# Altium project Pow_Dist_24_12_5v.PrjPcb
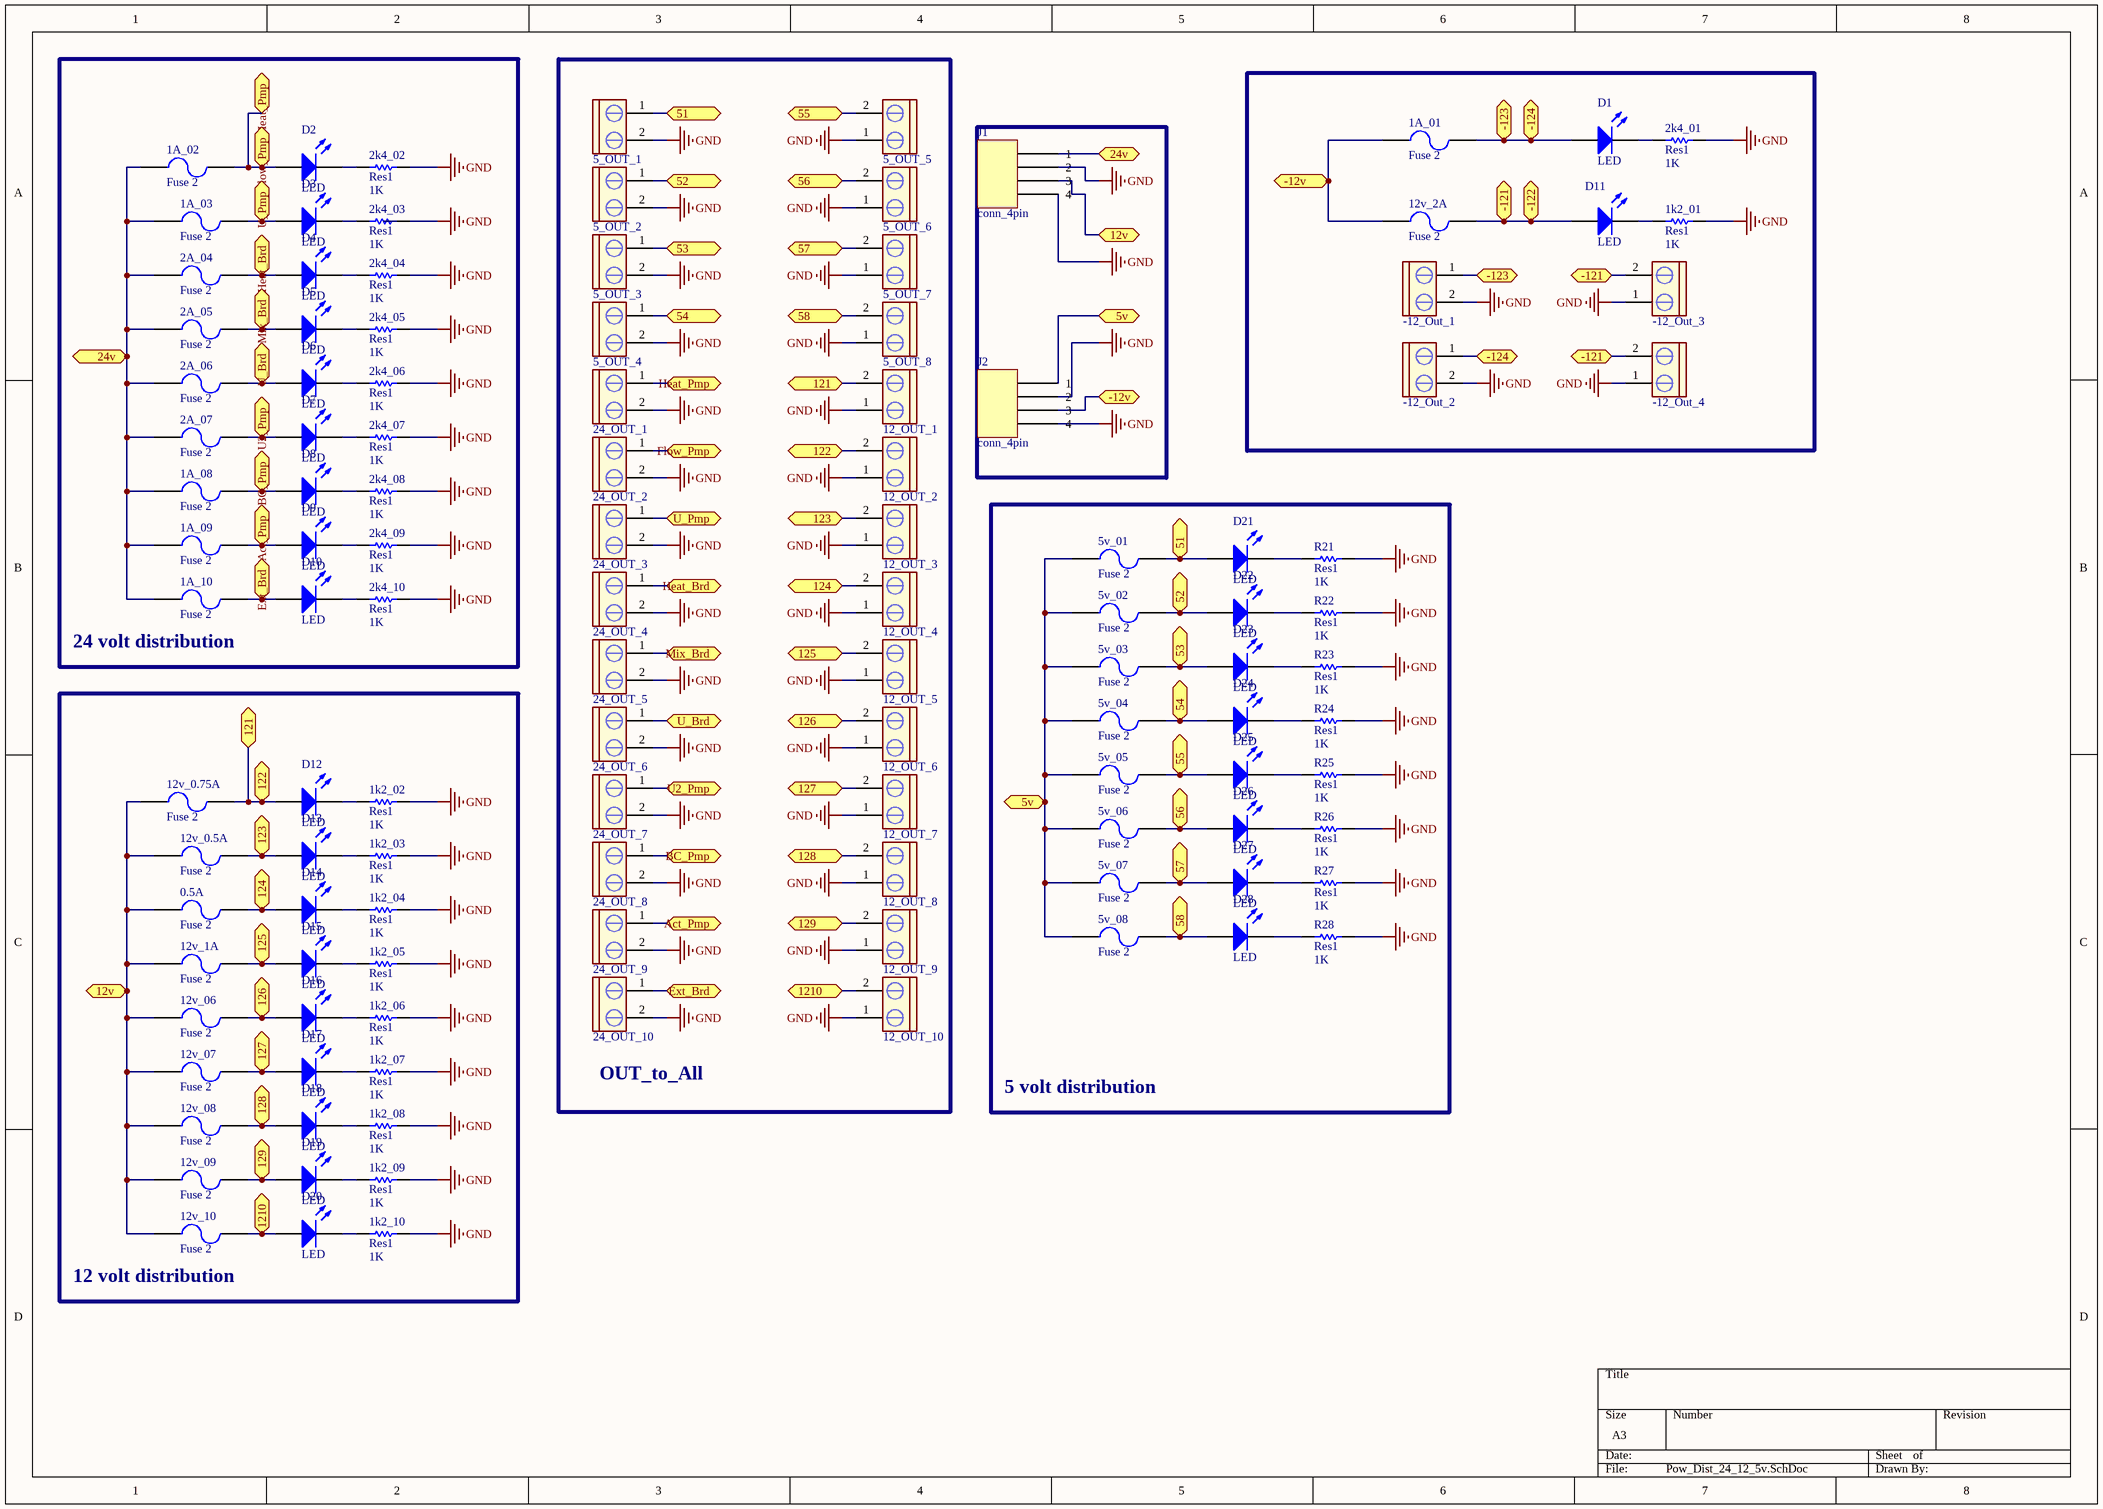
[diagram p0: Pow_Dist_24_12_5v.SchDoc]
2 sheets, 118 parts. Net scope: flat (ports and power ports of the same name join across sheets).
Board file: Pow_Dist_24_12_5v.PcbDoc
Sheets:
  Pow_Dist_24_12_5v.SchDoc
  Pow_Dist_24_12_5v_page2.SchDoc

## Sheet Pow_Dist_24_12_5v.SchDoc
size A3

### Parts
0.5A  Fuse 2  [PCBComponent_1]
1A_01  Fuse 2  [PCBComponent_1]
1A_02  Fuse 2  [PCBComponent_1]
1A_03  Fuse 2  [PCBComponent_1]
1A_08  Fuse 2  [PCBComponent_1]
1A_09  Fuse 2  [PCBComponent_1]
1A_10  Fuse 2  [PCBComponent_1]
1k2_01  Res1  value 1K  [AXIAL-0.3]
1k2_02  Res1  value 1K  [AXIAL-0.3]
1k2_03  Res1  value 1K  [AXIAL-0.3]
1k2_04  Res1  value 1K  [AXIAL-0.3]
1k2_05  Res1  value 1K  [AXIAL-0.3]
1k2_06  Res1  value 1K  [AXIAL-0.3]
1k2_07  Res1  value 1K  [AXIAL-0.3]
1k2_08  Res1  value 1K  [AXIAL-0.3]
1k2_09  Res1  value 1K  [AXIAL-0.3]
1k2_10  Res1  value 1K  [AXIAL-0.3]
2A_04  Fuse 2  [PCBComponent_1]
2A_05  Fuse 2  [PCBComponent_1]
2A_06  Fuse 2  [PCBComponent_1]
2A_07  Fuse 2  [PCBComponent_1]
2k4_01  Res1  value 1K  [AXIAL-0.3]
2k4_02  Res1  value 1K  [AXIAL-0.3]
2k4_03  Res1  value 1K  [AXIAL-0.3]
2k4_04  Res1  value 1K  [AXIAL-0.3]
2k4_05  Res1  value 1K  [AXIAL-0.3]
2k4_06  Res1  value 1K  [AXIAL-0.3]
2k4_07  Res1  value 1K  [AXIAL-0.3]
2k4_08  Res1  value 1K  [AXIAL-0.3]
2k4_09  Res1  value 1K  [AXIAL-0.3]
2k4_10  Res1  value 1K  [AXIAL-0.3]
5_OUT_1  CON2 pin blue  [My_CN2]  (value not drawn)
5_OUT_2  CON2 pin blue  [My_CN2]  (value not drawn)
5_OUT_3  CON2 pin blue  [My_CN2]  (value not drawn)
5_OUT_4  CON2 pin blue  [My_CN2]  (value not drawn)
5_OUT_5  CON2 pin blue  [My_CN2]  (value not drawn)
5_OUT_6  CON2 pin blue  [My_CN2]  (value not drawn)
5_OUT_7  CON2 pin blue  [My_CN2]  (value not drawn)
5_OUT_8  CON2 pin blue  [My_CN2]  (value not drawn)
5v_01  Fuse 2  [PCBComponent_1]
5v_02  Fuse 2  [PCBComponent_1]
5v_03  Fuse 2  [PCBComponent_1]
5v_04  Fuse 2  [PCBComponent_1]
5v_05  Fuse 2  [PCBComponent_1]
5v_06  Fuse 2  [PCBComponent_1]
5v_07  Fuse 2  [PCBComponent_1]
5v_08  Fuse 2  [PCBComponent_1]
12_OUT_1  CON2 pin blue  [My_CN2]  (value not drawn)
12_OUT_2  CON2 pin blue  [My_CN2]  (value not drawn)
12_OUT_3  CON2 pin blue  [My_CN2]  (value not drawn)
12_OUT_4  CON2 pin blue  [My_CN2]  (value not drawn)
12_OUT_5  CON2 pin blue  [My_CN2]  (value not drawn)
12_OUT_6  CON2 pin blue  [My_CN2]  (value not drawn)
12_OUT_7  CON2 pin blue  [My_CN2]  (value not drawn)
12_OUT_8  CON2 pin blue  [My_CN2]  (value not drawn)
12_OUT_9  CON2 pin blue  [My_CN2]  (value not drawn)
12_OUT_10  CON2 pin blue  [My_CN2]  (value not drawn)
12v_0.5A  Fuse 2  [PCBComponent_1]
12v_0.75A  Fuse 2  [PCBComponent_1]
12v_1A  Fuse 2  [PCBComponent_1]
12v_2A  Fuse 2  [PCBComponent_1]
12v_06  Fuse 2  [PCBComponent_1]
12v_07  Fuse 2  [PCBComponent_1]
12v_08  Fuse 2  [PCBComponent_1]
12v_09  Fuse 2  [PCBComponent_1]
12v_10  Fuse 2  [PCBComponent_1]
24_OUT_1  CON2 pin blue  [My_CN2]  (value not drawn)
24_OUT_2  CON2 pin blue  [My_CN2]  (value not drawn)
24_OUT_3  CON2 pin blue  [My_CN2]  (value not drawn)
24_OUT_4  CON2 pin blue  [My_CN2]  (value not drawn)
24_OUT_5  CON2 pin blue  [My_CN2]  (value not drawn)
24_OUT_6  CON2 pin blue  [My_CN2]  (value not drawn)
24_OUT_7  CON2 pin blue  [My_CN2]  (value not drawn)
24_OUT_8  CON2 pin blue  [My_CN2]  (value not drawn)
24_OUT_9  CON2 pin blue  [My_CN2]  (value not drawn)
24_OUT_10  CON2 pin blue  [My_CN2]  (value not drawn)
-12_Out_1  CON2 pin blue  [My_CN2]  (value not drawn)
-12_Out_2  CON2 pin blue  [My_CN2]  (value not drawn)
-12_Out_3  CON2 pin blue  [My_CN2]  (value not drawn)
-12_Out_4  CON2 pin blue  [My_CN2]  (value not drawn)
D1  LED  [My_LED3MM]
D2  LED  [My_LED3MM]
D3  LED  [My_LED3MM]
D4  LED  [My_LED3MM]
D5  LED  [My_LED3MM]
D6  LED  [My_LED3MM]
D7  LED  [My_LED3MM]
D8  LED  [My_LED3MM]
D9  LED  [My_LED3MM]
D10  LED  [My_LED3MM]
D11  LED  [My_LED3MM]
D12  LED  [My_LED3MM]
D13  LED  [My_LED3MM]
D14  LED  [My_LED3MM]
D15  LED  [My_LED3MM]
D16  LED  [My_LED3MM]
D17  LED  [My_LED3MM]
D18  LED  [My_LED3MM]
D19  LED  [My_LED3MM]
D20  LED  [My_LED3MM]
D21  LED  [My_LED3MM]
D22  LED  [My_LED3MM]
D23  LED  [My_LED3MM]
D24  LED  [My_LED3MM]
D25  LED  [My_LED3MM]
D26  LED  [My_LED3MM]
D27  LED  [My_LED3MM]
D28  LED  [My_LED3MM]
J1  conn_4pin  [conn_4pin]
J2  conn_4pin  [conn_4pin]
R21  Res1  value 1K  [AXIAL-0.3]
R22  Res1  value 1K  [AXIAL-0.3]
R23  Res1  value 1K  [AXIAL-0.3]
R24  Res1  value 1K  [AXIAL-0.3]
R25  Res1  value 1K  [AXIAL-0.3]
R26  Res1  value 1K  [AXIAL-0.3]
R27  Res1  value 1K  [AXIAL-0.3]
R28  Res1  value 1K  [AXIAL-0.3]

### Blocks framed on the sheet
24 volt distribution: 1A_02 1A_03 1A_08 1A_09 1A_10 2A_04 2A_05 2A_06 2A_07 2k4_02 2k4_03 2k4_04 2k4_05 2k4_06 2k4_07 2k4_08 2k4_09 2k4_10 D2-D10
OUT_to_All: 5_OUT_1-5_OUT_8 12_OUT_1-12_OUT_10 24_OUT_1-24_OUT_10
5 volt distribution: 5v_01 5v_02 5v_03 5v_04 5v_05 5v_06 5v_07 5v_08 D21-D28 R21-R28
12 volt distribution: 0.5A 1k2_02 1k2_03 1k2_04 1k2_05 1k2_06 1k2_07 1k2_08 1k2_09 1k2_10 12v_0.5A 12v_0.75A 12v_1A 12v_06 12v_07 12v_08 12v_09 12v_10 D12-D20

### Ports
5v, 12v, 24v, 51, 52, 53, 54, 55, 56, 57, 58, 121, 122, 123, 124, 125, 126, 127, 128, 129, 1210, -12v, -121, -122, -123, -124, Act_Pmp, BC_Pmp, Ext_Brd, Flow_Pmp, Heat_Brd, Heat_Pmp, Mix_Brd, U2_Pmp, U_Brd, U_Pmp

### Nets
GND: 1k2_01.2 1k2_02.2 1k2_03.2 1k2_04.2 1k2_05.2 1k2_06.2 1k2_07.2 1k2_08.2 1k2_09.2 1k2_10.2 2k4_01.2 2k4_02.2 2k4_03.2 2k4_04.2 2k4_05.2 2k4_06.2 2k4_07.2 2k4_08.2 2k4_09.2 2k4_10.2 5_OUT_1.2 5_OUT_2.2 5_OUT_3.2 5_OUT_4.2 5_OUT_5.1 5_OUT_6.1 5_OUT_7.1 5_OUT_8.1 12_OUT_1.1 12_OUT_2.1 12_OUT_3.1 12_OUT_4.1 12_OUT_5.1 12_OUT_6.1 12_OUT_7.1 12_OUT_8.1 12_OUT_9.1 12_OUT_10.1 24_OUT_1.2 24_OUT_2.2 24_OUT_3.2 24_OUT_4.2 24_OUT_5.2 24_OUT_6.2 24_OUT_7.2 24_OUT_8.2 24_OUT_9.2 24_OUT_10.2 -12_Out_1.2 -12_Out_2.2 -12_Out_3.1 -12_Out_4.1 R21.2 R22.2 R23.2 R24.2 R25.2 R26.2 R27.2 R28.2
Net0.5A_1: 0.5A.1 12v_0.5A.1 12v_0.75A.1 12v_1A.1 12v_06.1 12v_07.1 12v_08.1 12v_09.1 12v_10.1 ; port 12v
Net0.5A_2: 0.5A.2 12_OUT_4.2 D14.A ; port 124
Net1A_01_1: 1A_01.1 12v_2A.1 ; port -12v
Net1A_01_2: 1A_01.2 -12_Out_1.1 -12_Out_2.1 D1.A ; port -123, port -124
Net1A_02_1: 1A_02.1 1A_03.1 1A_08.1 1A_09.1 1A_10.1 2A_04.1 2A_05.1 2A_06.1 2A_07.1 ; port 24v
Net1A_02_2: 1A_02.2 24_OUT_1.1 24_OUT_2.1 D2.A ; port Heat_Pmp, port Flow_Pmp
Net1A_03_2: 1A_03.2 24_OUT_3.1 D3.A ; port U_Pmp
Net1A_08_2: 1A_08.2 24_OUT_8.1 D8.A ; port BC_Pmp
Net1A_09_2: 1A_09.2 24_OUT_9.1 D9.A ; port Act_Pmp
Net1A_10_2: 1A_10.2 24_OUT_10.1 D10.A ; port Ext_Brd
Net1k2_01_1: 1k2_01.1 D11.K
Net1k2_02_1: 1k2_02.1 D12.K
Net1k2_03_1: 1k2_03.1 D13.K
Net1k2_04_1: 1k2_04.1 D14.K
Net1k2_05_1: 1k2_05.1 D15.K
Net1k2_06_1: 1k2_06.1 D16.K
Net1k2_07_1: 1k2_07.1 D17.K
Net1k2_08_1: 1k2_08.1 D18.K
Net1k2_09_1: 1k2_09.1 D19.K
Net1k2_10_1: 1k2_10.1 D20.K
Net2A_04_2: 2A_04.2 24_OUT_4.1 D4.A ; port Heat_Brd
Net2A_05_2: 2A_05.2 24_OUT_5.1 D5.A ; port Mix_Brd
Net2A_06_2: 2A_06.2 24_OUT_6.1 D6.A ; port U_Brd
Net2A_07_2: 2A_07.2 24_OUT_7.1 D7.A ; port U2_Pmp
Net2k4_01_1: 2k4_01.1 D1.K
Net2k4_02_1: 2k4_02.1 D2.K
Net2k4_03_1: 2k4_03.1 D3.K
Net2k4_04_1: 2k4_04.1 D4.K
Net2k4_05_1: 2k4_05.1 D5.K
Net2k4_06_1: 2k4_06.1 D6.K
Net2k4_07_1: 2k4_07.1 D7.K
Net2k4_08_1: 2k4_08.1 D8.K
Net2k4_09_1: 2k4_09.1 D9.K
Net2k4_10_1: 2k4_10.1 D10.K
Net5_OUT_1_1: 5_OUT_1.1 5v_01.2 D21.A ; port 51
Net5_OUT_2_1: 5_OUT_2.1 5v_02.2 D22.A ; port 52
Net5_OUT_3_1: 5_OUT_3.1 5v_03.2 D23.A ; port 53
Net5_OUT_4_1: 5_OUT_4.1 5v_04.2 D24.A ; port 54
Net5_OUT_5_2: 5_OUT_5.2 5v_05.2 D25.A ; port 55
Net5_OUT_6_2: 5_OUT_6.2 5v_06.2 D26.A ; port 56
Net5_OUT_7_2: 5_OUT_7.2 5v_07.2 D27.A ; port 57
Net5_OUT_8_2: 5_OUT_8.2 5v_08.2 D28.A ; port 58
Net5v_01_1: 5v_01.1 5v_02.1 5v_03.1 5v_04.1 5v_05.1 5v_06.1 5v_07.1 5v_08.1 ; port 5v
Net12_OUT_1_2: 12_OUT_1.2 12_OUT_2.2 12v_0.75A.2 D12.A ; port 121, port 122
Net12_OUT_3_2: 12_OUT_3.2 12v_0.5A.2 D13.A ; port 123
Net12_OUT_5_2: 12_OUT_5.2 12v_1A.2 D15.A ; port 125
Net12_OUT_6_2: 12_OUT_6.2 12v_06.2 D16.A ; port 126
Net12_OUT_7_2: 12_OUT_7.2 12v_07.2 D17.A ; port 127
Net12_OUT_8_2: 12_OUT_8.2 12v_08.2 D18.A ; port 128
Net12_OUT_9_2: 12_OUT_9.2 12v_09.2 D19.A ; port 129
Net12_OUT_10_2: 12_OUT_10.2 12v_10.2 D20.A ; port 1210
Net12v_2A_2: 12v_2A.2 -12_Out_3.2 -12_Out_4.2 D11.A ; port -121, port -122
NetD21_K: D21.K R21.1
NetD22_K: D22.K R22.1
NetD23_K: D23.K R23.1
NetD24_K: D24.K R24.1
NetD25_K: D25.K R25.1
NetD26_K: D26.K R26.1
NetD27_K: D27.K R27.1
NetD28_K: D28.K R28.1

Not connected (* = marked no-connect by the designer): J1 1 2 3 4; J2 1 2 3 4

### Library data of the parts
0.5A 1A_01 1A_02 1A_03 1A_08 1A_09 1A_10 2A_04 2A_05 2A_06 2A_07 5v_01 5v_02 5v_03 5v_04 5v_05 5v_06 5v_07 5v_08 12v_0.5A 12v_0.75A 12v_1A 12v_2A 12v_06 12v_07 12v_08 12v_09 12v_10 = Fuse 2: Fuse; Published: 8-Jun-2000; LatestRevisionDate: 17-Jul-2002; LatestRevisionNote: Re-released for DXP Platform.; PackageReference: PIN-W2/E2.8; Publisher: Altium Limited; PackageDescription: Thru-Hole; 2 Leads
1k2_01 1k2_02 1k2_03 1k2_04 1k2_05 1k2_06 1k2_07 1k2_08 1k2_09 1k2_10 2k4_01 2k4_02 2k4_03 2k4_04 2k4_05 2k4_06 2k4_07 2k4_08 2k4_09 2k4_10 R21-R28 = Res1: Resistor; Published: 8-Jun-2000; LatestRevisionDate: 17-Jul-2002; LatestRevisionNote: Re-released for DXP Platform.; PackageReference: AXIAL-0.3; Publisher: Altium Limited; PackageDescription: Axial Device, Thru-Hole; 2 Leads; 0.3 in Pin Spacing
5_OUT_1-5_OUT_8 12_OUT_1-12_OUT_10 24_OUT_1-24_OUT_10 -12_Out_1--12_Out_4 = CON2 pin blue: Connector blue screw
D1-D28 = LED: Typical INFRARED GaAs LED; Published: 8-Jun-2000; LatestRevisionDate: 08-Jul-2005; LatestRevisionNote: Mech Layer 1 removed.; Publisher: Altium Limited

## Sheet Pow_Dist_24_12_5v_page2.SchDoc
size A4